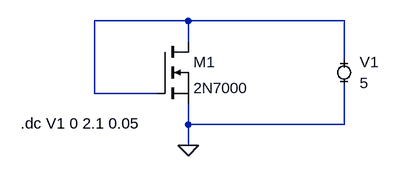
[diagram p0: schematic Draft1.asc]
Draft1.asc, the LTspice schematic file:
Version 4
SHEET 1 880 680
WIRE 112 64 -32 64
WIRE 352 64 112 64
WIRE 112 96 112 64
WIRE 352 128 352 64
WIRE -32 176 -32 64
WIRE 64 176 -32 176
WIRE 112 224 112 192
WIRE 352 224 352 160
WIRE 352 224 112 224
WIRE 112 256 112 224
FLAG 112 256 0
SYMBOL nmos 64 96 R0
SYMATTR InstName M1
SYMATTR Value 2N7000
SYMBOL MiniSyms4\\voltage- 352 144 R0
WINDOW 123 0 0 Left 0
WINDOW 39 0 0 Left 0
SYMATTR InstName V1
SYMATTR Value 5
TEXT -146 222 Left 2 !.dc V1 0 2.1 0.05

The netlist it stands for:
* Draft1.asc
M1 N001 N001 0 0 2N7000
V1 N001 0 5
.model NMOS NMOS
.model PMOS PMOS
.lib standard.mos
.dc V1 0 2.1 0.05
.backanno
.end